# Altium schematic sheet 0.COVER.SchDoc: COVER
size A3; SheetNumber: 0; SheetTotal: 16
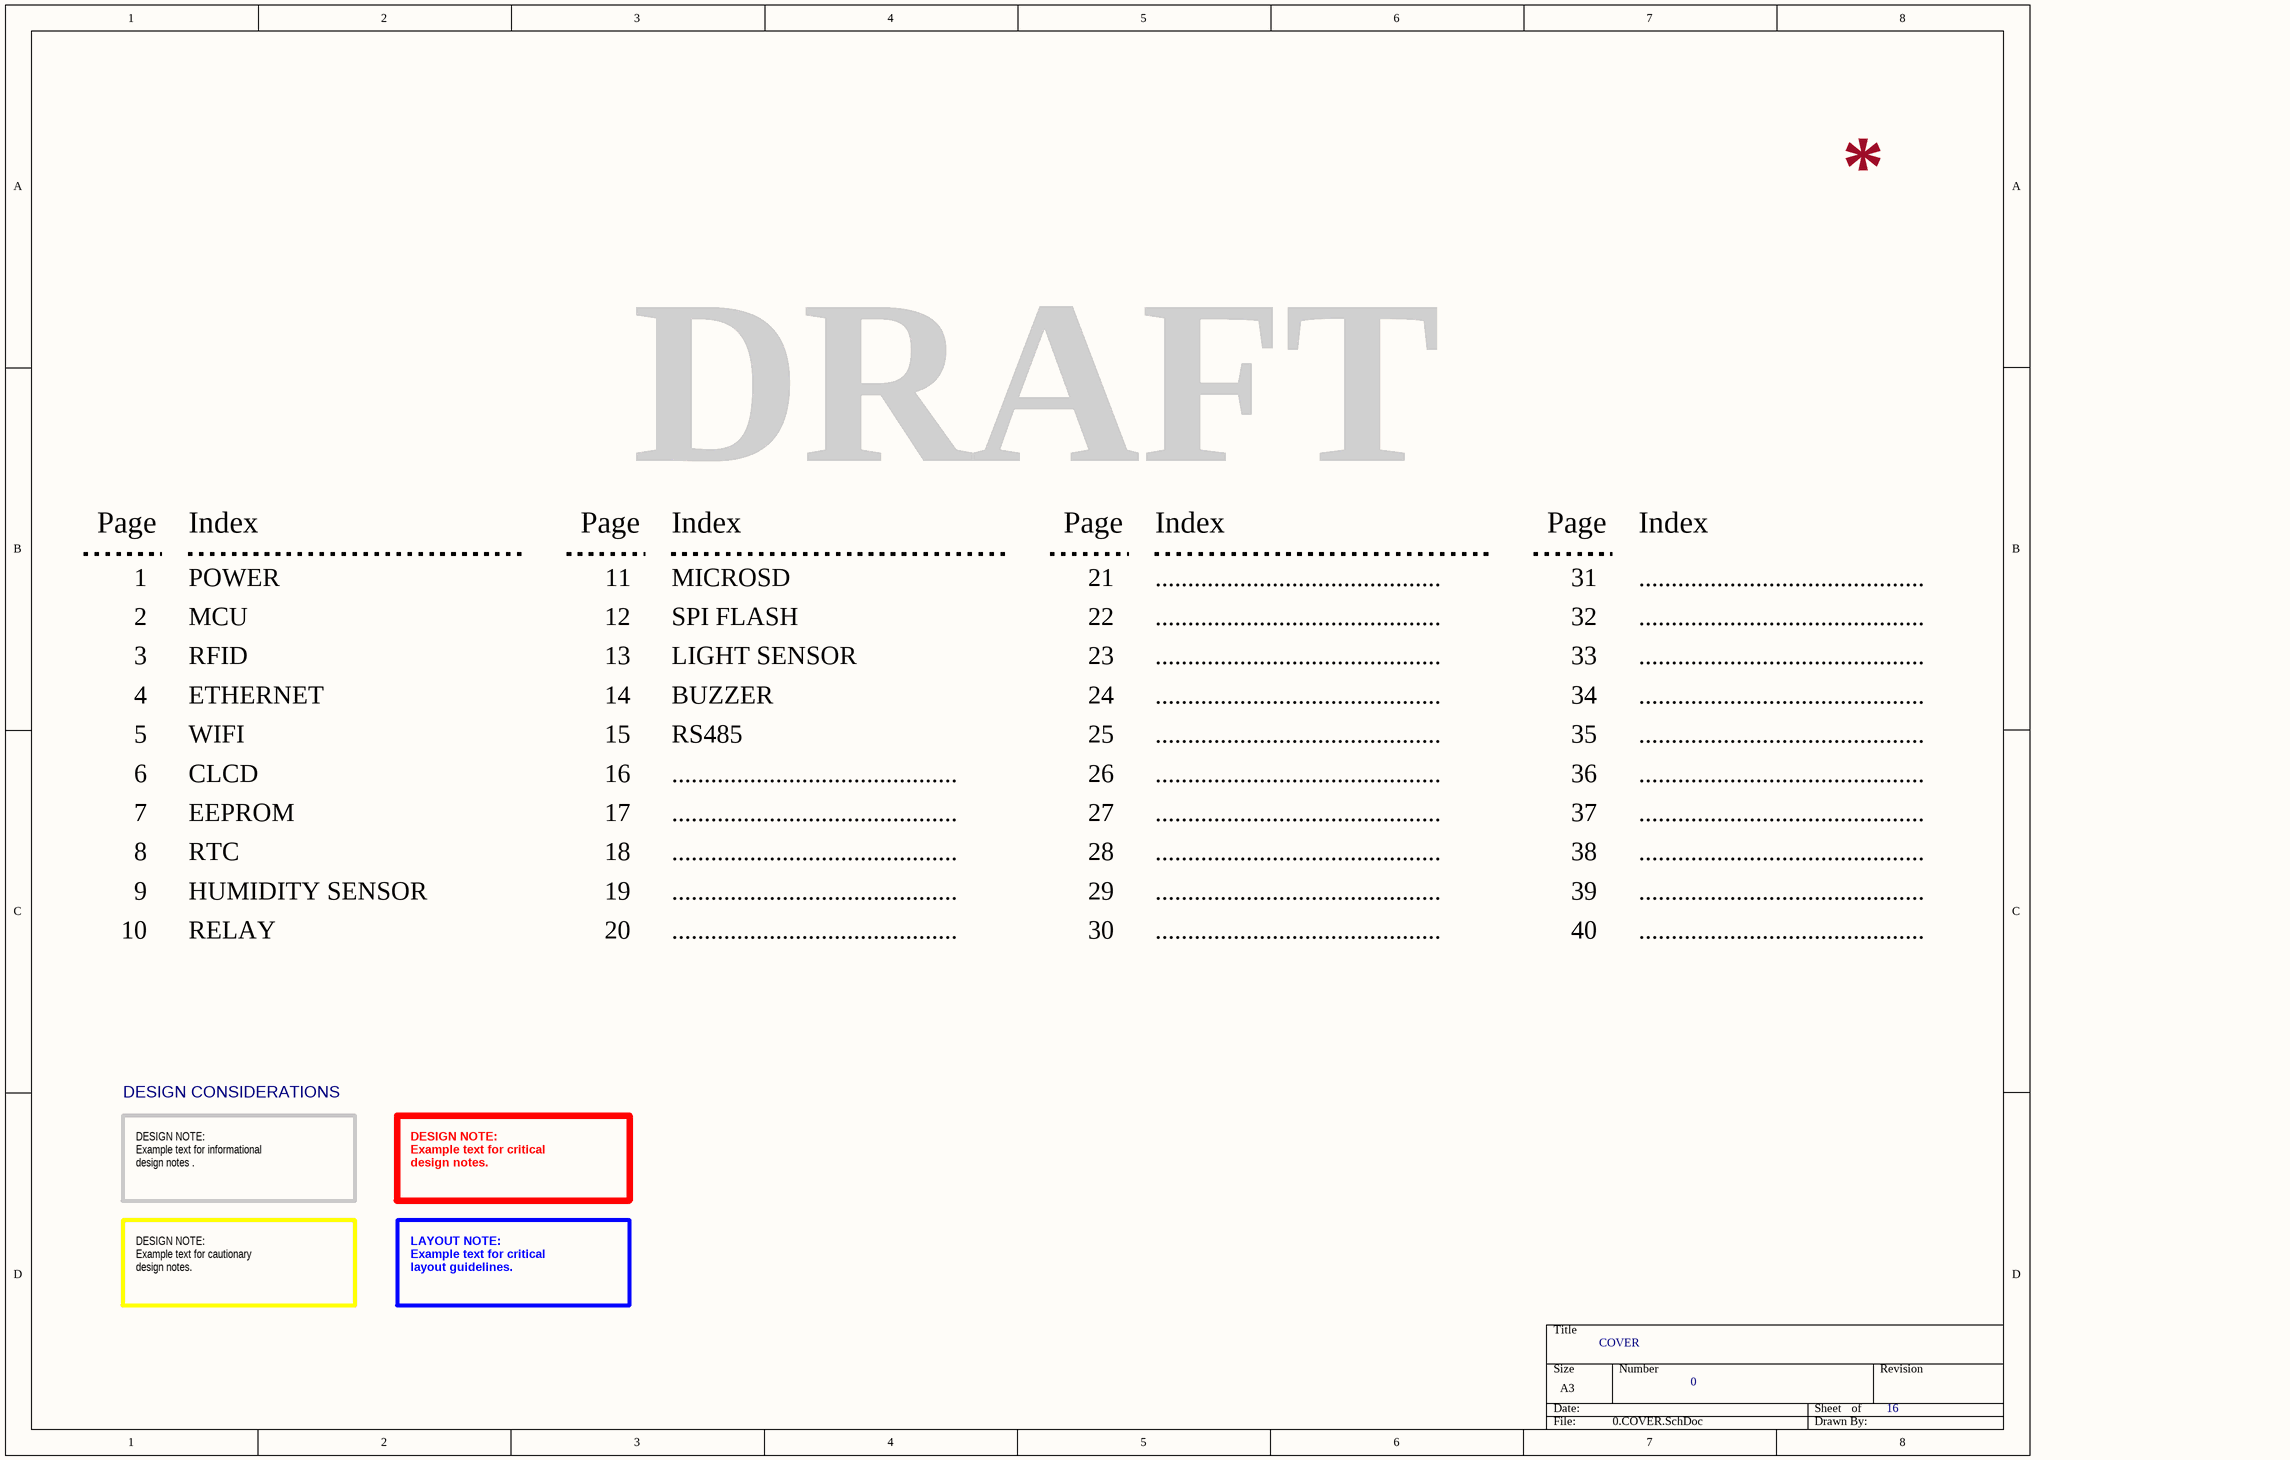
[diagram p0: 0.COVER.SchDoc]

## Notes on the sheet
- Page
- Index
- DRAFT
- 1
- 2
- POWER
- MCU
- 11
- 12
- MICROSD
- SPI FLASH
- 21
- 22
- ............................................
- 31
- 32
- 3
- RFID
- 13
- LIGHT SENSOR
- 23
- 33
- 4
- 5
- ETHERNET
- WIFI
- 14
- 15
- BUZZER
- RS485
- 24
- 25
- 34
- 35
- 6
- 7
- CLCD
- EEPROM
- 16
- 17
- 26
- 27
- 36
- 37
- 8
- RTC
- 18
- 28
- 38
- 9
- 10
- HUMIDITY SENSOR
- RELAY
- 19
- 20
- 29
- 30
- 39
- 40
- DESIGN CONSIDERATIONS
- DESIGN NOTE:
  Example text for informational
  design notes .
- DESIGN NOTE:
  Example text for critical
  design notes.
- DESIGN NOTE:
  Example text for cautionary
  design notes.
- LAYOUT NOTE:
  Example text for critical
  layout guidelines.